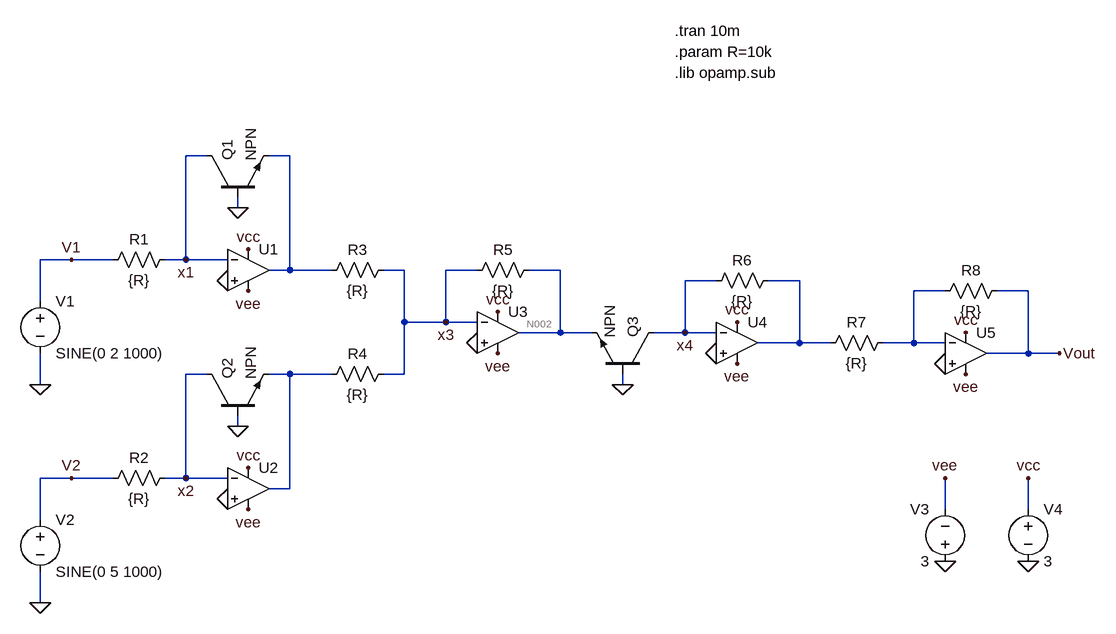
[diagram p0: schematic multiplier.asc]
multiplier.asc, the LTspice schematic file:
Version 4.1
SHEET 1 1364 680
WIRE -192 -304 -224 -304
WIRE -64 -304 -96 -304
WIRE -144 -224 -144 -240
WIRE -400 -144 -448 -144
WIRE -336 -144 -400 -144
WIRE -224 -144 -224 -304
WIRE -224 -144 -256 -144
WIRE -160 -144 -224 -144
WIRE -64 -128 -64 -304
WIRE -64 -128 -96 -128
WIRE 0 -128 -64 -128
WIRE 112 -128 80 -128
WIRE 224 -128 176 -128
WIRE 352 -128 304 -128
WIRE 592 -112 544 -112
WIRE 720 -112 672 -112
WIRE 944 -96 896 -96
WIRE 1072 -96 1024 -96
WIRE -448 -80 -448 -144
WIRE 112 -48 112 -128
WIRE 176 -48 176 -128
WIRE 176 -48 112 -48
WIRE 224 -48 176 -48
WIRE 352 -32 352 -128
WIRE 352 -32 288 -32
WIRE 400 -32 352 -32
WIRE 544 -32 544 -112
WIRE 544 -32 496 -32
WIRE 592 -32 544 -32
WIRE 720 -16 720 -112
WIRE 720 -16 656 -16
WIRE 768 -16 720 -16
WIRE 896 -16 896 -96
WIRE 896 -16 848 -16
WIRE 944 -16 896 -16
WIRE 1072 0 1072 -96
WIRE 1072 0 1008 0
WIRE 1120 0 1072 0
WIRE -192 32 -224 32
WIRE -64 32 -96 32
WIRE 0 32 -64 32
WIRE 112 32 112 -48
WIRE 112 32 80 32
WIRE -448 48 -448 0
WIRE 448 48 448 32
WIRE -144 112 -144 96
WIRE -400 192 -448 192
WIRE -336 192 -400 192
WIRE -224 192 -224 32
WIRE -224 192 -256 192
WIRE -160 192 -224 192
WIRE -64 208 -64 32
WIRE -64 208 -96 208
WIRE 944 240 944 192
WIRE 1072 240 1072 192
WIRE -448 256 -448 192
WIRE -448 384 -448 336
FLAG -448 48 0
FLAG -144 -224 0
FLAG -224 -144 x1
FLAG -448 384 0
FLAG -144 112 0
FLAG -224 192 x2
FLAG 176 -48 x3
FLAG 448 48 0
FLAG 544 -32 x4
FLAG 1120 0 Vout
FLAG -128 -96 vee
FLAG -128 240 vee
FLAG 256 0 vee
FLAG 624 16 vee
FLAG 976 32 vee
FLAG -128 -160 vcc
FLAG 256 -64 vcc
FLAG -128 176 vcc
FLAG 624 -48 vcc
FLAG 976 -32 vcc
FLAG -160 -112 0
FLAG 224 -16 0
FLAG 592 0 0
FLAG 944 16 0
FLAG -160 224 0
FLAG 944 320 0
FLAG 1072 320 0
FLAG -400 192 V2
FLAG -400 -144 V1
FLAG 944 192 vee
FLAG 1072 192 vcc
SYMBOL npn -192 -240 R270
SYMATTR InstName Q1
SYMBOL voltage -448 -96 R0
WINDOW 123 0 0 Left 0
WINDOW 39 0 0 Left 0
SYMATTR InstName V1
SYMATTR Value SINE(0 2 1000)
SYMBOL res -240 -160 R90
WINDOW 0 0 56 VBottom 2
WINDOW 3 32 56 VTop 2
SYMATTR InstName R1
SYMATTR Value {R}
SYMBOL npn -192 96 R270
SYMATTR InstName Q2
SYMBOL voltage -448 240 R0
WINDOW 123 0 0 Left 0
WINDOW 39 0 0 Left 0
SYMATTR InstName V2
SYMATTR Value SINE(0 5 1000)
SYMBOL res -240 176 R90
WINDOW 0 0 56 VBottom 2
WINDOW 3 32 56 VTop 2
SYMATTR InstName R2
SYMATTR Value {R}
SYMBOL res 96 -144 R90
WINDOW 0 0 56 VBottom 2
WINDOW 3 32 56 VTop 2
SYMATTR InstName R3
SYMATTR Value {R}
SYMBOL res 96 16 R90
WINDOW 0 0 56 VBottom 2
WINDOW 3 32 56 VTop 2
SYMATTR InstName R4
SYMATTR Value {R}
SYMBOL res 320 -144 R90
WINDOW 0 0 56 VBottom 2
WINDOW 3 32 56 VTop 2
SYMATTR InstName R5
SYMATTR Value {R}
SYMBOL npn 496 32 M270
SYMATTR InstName Q3
SYMBOL res 688 -128 R90
WINDOW 0 0 56 VBottom 2
WINDOW 3 32 56 VTop 2
SYMATTR InstName R6
SYMATTR Value {R}
SYMBOL res 864 -32 R90
WINDOW 0 0 56 VBottom 2
WINDOW 3 32 56 VTop 2
SYMATTR InstName R7
SYMATTR Value {R}
SYMBOL res 1040 -112 R90
WINDOW 0 0 56 VBottom 2
WINDOW 3 32 56 VTop 2
SYMATTR InstName R8
SYMATTR Value {R}
SYMBOL voltage 944 336 R180
WINDOW 0 24 96 Left 2
WINDOW 3 24 16 Left 2
SYMATTR InstName V3
SYMATTR Value 3
SYMBOL voltage 1072 224 R0
SYMATTR InstName V4
SYMATTR Value 3
SYMBOL OpAmps\\UniversalOpAmp2 -128 -128 R0
SYMATTR InstName U1
SYMBOL OpAmps\\UniversalOpAmp2 -128 208 R0
SYMATTR InstName U2
SYMBOL OpAmps\\UniversalOpAmp2 256 -32 R0
SYMATTR InstName U3
SYMBOL OpAmps\\UniversalOpAmp2 624 -16 R0
SYMATTR InstName U4
SYMBOL OpAmps\\UniversalOpAmp2 976 0 R0
SYMATTR InstName U5
TEXT 528 -496 Left 2 !.tran 10m
TEXT 528 -464 Left 2 !.param R=10k
TEXT 528 -432 Left 2 !.lib opamp.sub

The netlist it stands for:
* multiplier.asc
Q1 x1 0 N001 0 NPN
V1 V1 0 SINE(0 2 1000)
R1 x1 V1 {R}
Q2 x2 0 N005 0 NPN
V2 V2 0 SINE(0 5 1000)
R2 x2 V2 {R}
R3 x3 N001 {R}
R4 x3 N005 {R}
R5 N002 x3 {R}
Q3 x4 0 N002 0 NPN
R6 N003 x4 {R}
R7 N004 N003 {R}
R8 Vout N004 {R}
V3 0 vee 3
V4 vcc 0 3
X§U1 0 x1 vcc vee N001 level2 Avol=1Meg GBW=10Meg Slew=10Meg Ilimit=25m Rail=0 Vos=0 En=0 Enk=0 In=0 Ink=0 Rin=500Meg  ; pins In+ In- V+ V- OUT
X§U2 0 x2 vcc vee N005 level2 Avol=1Meg GBW=10Meg Slew=10Meg Ilimit=25m Rail=0 Vos=0 En=0 Enk=0 In=0 Ink=0 Rin=500Meg  ; pins In+ In- V+ V- OUT
X§U3 0 x3 vcc vee N002 level2 Avol=1Meg GBW=10Meg Slew=10Meg Ilimit=25m Rail=0 Vos=0 En=0 Enk=0 In=0 Ink=0 Rin=500Meg  ; pins In+ In- V+ V- OUT
X§U4 0 x4 vcc vee N003 level2 Avol=1Meg GBW=10Meg Slew=10Meg Ilimit=25m Rail=0 Vos=0 En=0 Enk=0 In=0 Ink=0 Rin=500Meg  ; pins In+ In- V+ V- OUT
X§U5 0 N004 vcc vee Vout level2 Avol=1Meg GBW=10Meg Slew=10Meg Ilimit=25m Rail=0 Vos=0 En=0 Enk=0 In=0 Ink=0 Rin=500Meg  ; pins In+ In- V+ V- OUT
.model NPN NPN
.model PNP PNP
.lib standard.bjt
.tran 10m
.param R=10k
.lib opamp.sub
.lib UniversalOpAmp2.lib
.backanno
.end

* Results of the author's LTspice run, read from the files saved beside the schematic
* Operating Point, zero values left out:
*   V(vcc) = 3 V
*   V(vee) = -3 V
*   I(V3) = -1.5 mA
*   I(V4) = -1.5 mA
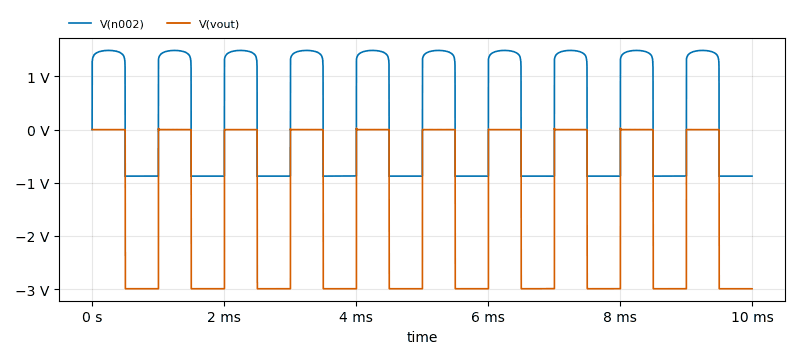
[diagram p1: Transient Analysis of multiplier.asc, plotted from the saved traces]
* Transient Analysis, 1 run:
*   V(n002): min -874.7 mV, max 1.49 V, average 281.6 mV, rms 1.198 V, last -874.4 mV
*   V(vout): min -2.993 V, max 26.55 mV, average -1.508 V, rms 2.124 V, last -2.992 V